# Altium project KS2E-BSPD.PrjPcb
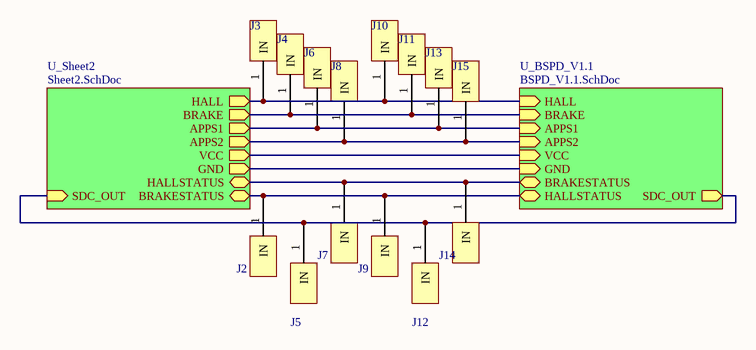
[diagram p0: Sheet3.SchDoc]
3 sheets, 59 parts. Net scope: hierarchical (ports join the sheet entries above them; power ports are global).
Board file: BSPD_V1.1.PcbDoc
Sheets:
  Sheet3.SchDoc
    U_BSPD_V1.1 = BSPD_V1.1.SchDoc
    U_Sheet2 = Sheet2.SchDoc

## Sheet Sheet3.SchDoc
size A; SheetNumber: 1; SheetTotal: 3

### Parts
J2  22AWG JUMPER  [22 AWG Hole]  (value not drawn)
J3  22AWG JUMPER  [22 AWG Hole]  (value not drawn)
J4  22AWG JUMPER  [22 AWG Hole]  (value not drawn)
J5  22AWG JUMPER  [22 AWG Hole]  (value not drawn)
J6  22AWG JUMPER  [22 AWG Hole]  (value not drawn)
J7  22AWG JUMPER  [22 AWG Hole]  (value not drawn)
J8  22AWG JUMPER  [22 AWG Hole]  (value not drawn)
J9  22AWG JUMPER  [22 AWG Hole]  (value not drawn)
J10  22AWG JUMPER  [22 AWG Hole]  (value not drawn)
J11  22AWG JUMPER  [22 AWG Hole]  (value not drawn)
J12  22AWG JUMPER  [22 AWG Hole]  (value not drawn)
J13  22AWG JUMPER  [22 AWG Hole]  (value not drawn)
J14  22AWG JUMPER  [22 AWG Hole]  (value not drawn)
J15  22AWG JUMPER  [22 AWG Hole]  (value not drawn)

### Sub-sheets
U_BSPD_V1.1 = BSPD_V1.1.SchDoc: SDC_OUT (out), HALL (in), BRAKE (in), APPS1 (in), APPS2 (in), VCC (in), GND (in), BRAKESTATUS (bidir), HALLSTATUS (bidir)
U_Sheet2 = Sheet2.SchDoc: SDC_OUT (in), HALL (out), BRAKE (out), APPS1 (out), APPS2 (out), VCC (out), GND (out), BRAKESTATUS (bidir), HALLSTATUS (bidir)

### Nets
GND: sheet U_BSPD_V1.1/GND, sheet U_Sheet2/GND
VCC: sheet U_BSPD_V1.1/VCC, sheet U_Sheet2/VCC
APPS1: J6.1(IN) J13.1(IN) ; sheet U_BSPD_V1.1/APPS1, sheet U_Sheet2/APPS1
APPS2: J8.1(IN) J15.1(IN) ; sheet U_BSPD_V1.1/APPS2, sheet U_Sheet2/APPS2
BRAKE: J4.1(IN) J11.1(IN) ; sheet U_BSPD_V1.1/BRAKE, sheet U_Sheet2/BRAKE
BRAKECHECK: J7.1(IN) J14.1(IN) ; sheet U_BSPD_V1.1/BRAKESTATUS, sheet U_Sheet2/HALLSTATUS
HALL: J3.1(IN) J10.1(IN) ; sheet U_BSPD_V1.1/HALL, sheet U_Sheet2/HALL
HALLCHECK: J2.1(IN) J9.1(IN) ; sheet U_BSPD_V1.1/HALLSTATUS, sheet U_Sheet2/BRAKESTATUS
NetJ5_1: J5.1(IN) J12.1(IN) ; sheet U_BSPD_V1.1/SDC_OUT, sheet U_Sheet2/SDC_OUT

## Sheet BSPD_V1.1.SchDoc
size A; SheetNumber: 2; SheetTotal: 3
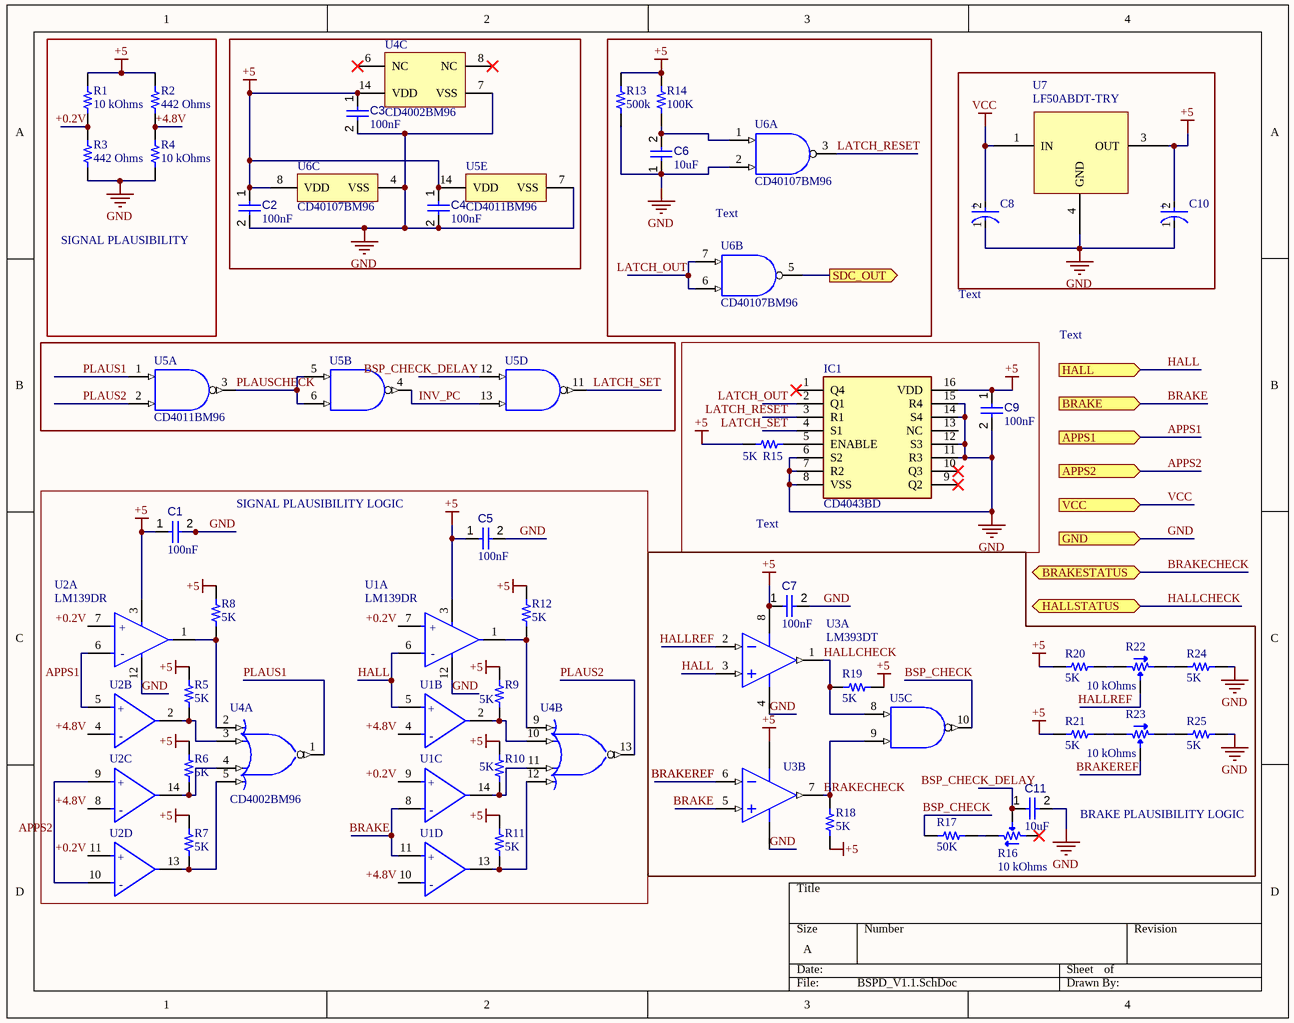
[diagram p1: BSPD_V1.1.SchDoc]

### Parts
C1  value 100nF  [CAPC1608X90X40NL10T20]  (hidden comment: Capacitor 100 nF +/-10% 50 V 0603)
C2  value 100nF  [CAPC1608X90X40NL10T20]  (hidden comment: Capacitor 100 nF +/-10% 50 V 0603)
C3  value 100nF  [CAPC1608X90X40NL10T20]  (hidden comment: Capacitor 100 nF +/-10% 50 V 0603)
C4  value 100nF  [CAPC1608X90X40NL10T20]  (hidden comment: Capacitor 100 nF +/-10% 50 V 0603)
C5  value 100nF  [CAPC1608X90X40NL10T20]  (hidden comment: Capacitor 100 nF +/-10% 50 V 0603)
C6  value 10uF  [CAPC1608X90X40NL10T20]  (hidden comment: Capacitor 100 nF +/-10% 50 V 0603)
C7  value 100nF  [CAPC1608X90X40NL10T20]  (hidden comment: Capacitor 100 nF +/-10% 50 V 0603)
C8  EEEFK1E100R  [FP-FKB-MFG]  (value not drawn)
C9  value 100nF  [CAPC1608X90X40NL10T20]  (hidden comment: Capacitor 100 nF +/-10% 50 V 0603)
C10  EEEFK1E100R  [FP-FKB-MFG]  (value not drawn)
C11  value 10uF  [CAPC1608X90X40NL10T20]  (hidden comment: Capacitor 100 nF +/-10% 50 V 0603)
IC1  CD4043BD  [SOIC127P600X175-16N]
R1  10 kOhms  [RES 0603_1608]
R2  442 Ohms  [RES 0603_1608]
R3  442 Ohms  [RES 0603_1608]
R4  10 kOhms  [RES 0603_1608]
R5  5K  [RES 0603_1608]
R6  5K  [RES 0603_1608]
R7  5K  [RES 0603_1608]
R8  5K  [RES 0603_1608]
R9  5K  [RES 0603_1608]
R10  5K  [RES 0603_1608]
R11  5K  [RES 0603_1608]
R12  5K  [RES 0603_1608]
R13  500k  [RES 0603_1608]
R14  100K  [RES 0603_1608]
R15  5K  [RES 0603_1608]
R16  10 kOhms  [POT BOURNS TRIMPOT TC33]
R17  50K  [RES 0603_1608]
R18  5K  [RES 0603_1608]
R19  5K  [RES 0603_1608]
R20  5K  [RES 0603_1608]
R21  5K  [RES 0603_1608]
R22  10 kOhms  [POT BOURNS TRIMPOT TC33]
R23  10 kOhms  [POT BOURNS TRIMPOT TC33]
R24  5K  [RES 0603_1608]
R25  5K  [RES 0603_1608]
U1  LM139DR  [FP-D0014A-IPC_C]  (parts A,B,C,D of 4)
U2  LM139DR  [FP-D0014A-IPC_C]  (parts A,B,C,D of 4)
U3  LM393DT  [STM-SO-8_D_L]  (parts A,B of 2)
U4  CD4002BM96  [D0014A_L]  (parts A,B,C of 3)
U5  CD4011BM96  [D0014A_L]  (parts A,B,C,D,E of 5)
U6  CD40107BM96  [D0008A_N]  (parts A,B,C of 3)
U7  LF50ABDT-TRY  [DPAK228P972X238-3N]

### Blocks framed on the sheet
SIGNAL PLAUSIBILITY: R1-R4
Text: C6 R13 R14 U6
Text: C9 IC1 R15
SIGNAL PLAUSIBILITY LOGIC: C1 C5 R5-R12 U1 U2 U4
BRAKE PLAUSIBILITY LOGIC: C7 C11 R16-R25 U3 U5

### Ports
APPS1 (in), APPS2 (in), BRAKE (in), BRAKESTATUS (bidir), GND (in), HALL (in), HALLSTATUS (bidir), SDC_OUT (out), VCC (in)

### Nets
+5: C1.1 C2.1 C3.1 C4.1 C5.1 C7.1 C9.1 C10.2(A) IC1.16(VDD) R1.2 R2.1 R5.1 R6.1 R7.1 R8.1 R9.1 R10.1 R11.1 R12.1 R13.2 R14.2 R15.2 R18.1 R19.1 R20.1 R21.1 U1.3(VCC) U2.3(VCC) U3.8(VCC+) U4.14(VDD) U5.14(VDD) U6.8(VDD) U7.3(OUT)
GND: C1.2 C2.2 C3.2 C4.2 C5.2 C6.1 C7.2 C8.1(C) C9.2 C10.1(C) C11.2 IC1.6(S2) IC1.7(R2) IC1.8(VSS) IC1.11(R3) IC1.12(S3) IC1.14(S4) IC1.15(R4) R3.1 R4.1 R13.1 R24.1 R25.1 U1.12(GND) U2.12(GND) U3.4(VCC-) U4.7(VSS) U5.7(VSS) U6.2(B) U6.4(VSS) U7.4(GND) ; port GND
VCC: C8.2(A) U7.1(IN) ; port VCC
+0.2V: R1.1 R3.2 U1.7(1IN+) U1.9(3IN+) U2.7(1IN+) U2.11(4IN+)
+4.8V: R2.2 R4.2 U1.4(2IN-) U1.10(4IN-) U2.4(2IN-) U2.8(3IN-)
APPS1: U2.5(2IN+) U2.6(1IN-) ; port APPS1
APPS2: U2.9(3IN+) U2.10(4IN-) ; port APPS2
BRAKE: U1.8(3IN-) U1.11(4IN+) U3.5(IN2+) ; port BRAKE
BRAKECHECK: R18.2 U3.7(OUT2) U5.9(F) ; port BRAKESTATUS
BRAKEREF: R23.2 U3.6(IN2-)
BSP_CHECK: R17.2 U5.10(L)
BSP_CHECK_DELAY: C11.1 R16.2 U5.12(G)
HALL: U1.5(2IN+) U1.6(1IN-) U3.3(IN1+) ; port HALL
HALLCHECK: R19.2 U3.1(OUT1) U5.8(E) ; port HALLSTATUS
HALLREF: R22.2 U3.2(IN1-)
INV_PC: U5.4(K) U5.13(H)
LATCH_OUT: IC1.2(Q1) U6.6(E) U6.7(D)
LATCH_RESET: IC1.3(R1) U6.3(C)
LATCH_SET: IC1.4(S1) U5.11(M)
PLAUS1: U4.1(J) U5.1(A)
PLAUS2: U4.13(K) U5.2(B)
PLAUSCHECK: U5.3(J) U5.5(C) U5.6(D)
NetC6_2: C6.2 R14.1 U6.1(A)
NetIC1_5: IC1.5(ENABLE) R15.1
NetJ5_1: U6.5(F) ; port SDC_OUT
NetR5_2: R5.2 U2.2(2OUT) U4.3(B)
NetR6_2: R6.2 U2.14(OUT3) U4.4(C)
NetR7_2: R7.2 U2.13(OUT4) U4.5(D)
NetR8_2: R8.2 U2.1(1OUT) U4.2(A)
NetR9_2: R9.2 U1.2(2OUT) U4.10(F)
NetR10_2: R10.2 U1.14(OUT3) U4.11(G)
NetR11_2: R11.2 U1.13(OUT4) U4.12(H)
NetR12_2: R12.2 U1.1(1OUT) U4.9(E)
NetR16_3: R16.3 R17.1
NetR20_2: R20.2 R22.1
NetR21_2: R21.2 R23.1
NetR22_3: R22.3 R24.2
NetR23_3: R23.3 R25.2

Not connected (* = marked no-connect by the designer): IC1 1(Q4)* 9(Q2)* 10(Q3)* 13(NC); R16 1*; U4 6(NC)* 8(NC)*

### Notes on the sheet
- Text
- (in symbol CMP-04896-000042-1, part A) +; -
- (in symbol CMP-04896-000042-1, part B) +; -
- (in symbol CMP-04896-000042-1, part C) +; -
- (in symbol CMP-04896-000042-1, part D) +; -
- (in symbol CMP-05427-000055-1) +

### Library data of the parts
C1-C7 C9 C11 = CMP-001-00017-6: Chip Capacitor, 100 nF, +/- 10%, 50 V, 0603 (1608 Metric); Voltage Rating: 50V; Capacitor Type: Ceramic; Tolerance: 10%; Mounting Technology: SM; Max Operating Temperature: 125°C; RoHS Compliant: True; Pins: 2; Case/Package: 0603; Min Operating Temperature: -55°C
C8 C10 = CMP-05427-000055-1: CAP ALUM 10UF 20% 25V SMD; ESR (Equivalent Series Resistance): 1.35R; Life (Hours): 2000Hour; Dielectric Material: Aluminium; Leakage Current: 3uA; Ripple Current (AC): 90mA; Polarity: Polar; Voltage: 25V; Voltage Rating: 25V; Number of Pins: 2; Package Quantity: 1; Max Operating Temperature: 105°C; Tolerance: 20%; Voltage Rating (DC): 25V; Packaging: Tape and Reel; Impedance: 1.35R; Case/Package: Radial; Series: FK; Height - Seated (Max): 0.24inch; Diameter: 4mm; Length: 5.8mm; Construction: Cylindrical; Height: 5.8mm; Mount: Surface Mount; REACH SVHC: No SVHC; Termination: SMD/SMT; Capacitance: 10uF; Lead Free: Lead Free; RoHS Compliant: Yes; Contact Plating: Tin; Width: 5.5mm; Radiation Hardening: No; Min Operating Temperature: -55°C; Ripple Current: 90mA
IC1 = CD4043BD: Integrated Circuit; Manufacturer_Name: Texas Instruments; Datasheet Link: http://www.ti.com/lit/gpn/CD4043B; Height: 1.75mm; Manufacturer_Part_Number: CD4043BD; Mouser Part Number: 595-CD4043BD; Mouser Price/Stock: https://www.mouser.co.uk/ProductDetail/Texas-Instruments/CD4043BD?qs=LSR%252BNeaw%2FwBT%2FmtVlwfGdg%3D%3D; Arrow Part Number: CD4043BD; Arrow Price/Stock: https://www.arrow.com/en/products/cd4043bd/texas-instruments
R1 R4 = CPF0603B10KE: RES SMD 10K OHM 0.1% 1/16W 0603; Manufacturer: TE Connectivity Passive Product; Power (Watts): 0.063W, 1/16W; Temperature Coefficient: ±25ppm/°C; Part Number: CPF0603B10KE; Value: 10 kOhms; ComponentLink1Description: Datasheet; ComponentLink1URL: https://www.te.com/commerce/DocumentDelivery/DDEController?Action=srchrtrv&DocNm=1773200&DocType=DS&DocLang=English; ComponentLink2Description: DigiKey Link; ComponentLink2URL: http://digikey.com/product-detail/en/te-connectivity-passive-product/CPF0603B10KE/A119886CT-ND/4966484; Composition: Thin Film; Device Package: 0603 (1608 Metric); Height - Seated (Max): 0.022" (0.55mm); LastUpdated: 9/2/2020 1:10:25 AM; Lifecycle Status: Active; Minimum Order: 1; Number of Terminations: 2; Operating Temperature: -55°C ~ 155°C; Package / Case: 0603 (1608 Metric); Packaging: TapeAndReel; PartId: 4872; Part Status: Active; Price: 0.09; Resistance: 10 kOhms; Series: CPF, Neohm; Size / Dimension: 0.061" L x 0.031" W (1.55mm x 0.80mm); Supplier 1: DigiKey; Supplier Part Number 1: A119886CT-ND; Supplier Device Package: 0603; Tolerance: ±0.1%
R2 R3 = RK73H1JTTD4420F: RES 442 OHM 1% 1/8W 0603; Manufacturer: KOA Speer Electronics, Inc.; Power (Watts): 0.125W, 1/8W; Temperature Coefficient: ±100ppm/°C; Part Number: RK73H1JTTD4420F; Value: 442 Ohms; ComponentLink1Description: Datasheet; ComponentLink1URL: http://www.koaspeer.com/catimages/Products/RK73H/RK73H.pdf; ComponentLink2Description: DigiKey Link; ComponentLink2URL: http://digikey.com/product-detail/en/koa-speer-electronics-inc/RK73H1JTTD4420F/2019-RK73H1JTTD4420FCT-ND/9847257; Composition: Thick Film; Device Package: 0603 (1608 Metric); Features: Automotive AEC-Q200, Moisture Resistant; Height - Seated (Max): 0.022" (0.55mm); LastUpdated: 9/2/2020 1:09:26 AM; Lifecycle Status: Active; Minimum Order: 1; Number of Terminations: 2; Operating Temperature: -55°C ~ 155°C; Package / Case: 0603 (1608 Metric); Packaging: CutTape; PartId: 26603; Part Status: Active; Price: 0.10; Ratings: AEC-Q200; Resistance: 442 Ohms; Series: RK73H; Size / Dimension: 0.063" L x 0.031" W (1.60mm x 0.80mm); Supplier 1: DigiKey; Supplier Part Number 1: 2019-RK73H1JTTD4420FCT-ND; Supplier Device Package: 0603; Tolerance: ±1%
R5-R12 R15 R18-R21 R24 R25 = CRGP0603F5K6: CRGP 0603 5K6 1%; Manufacturer: TE Connectivity Passive Product; Power (Watts): 0.25W, 1/4W; Resistance: 5.6 kOhms; Temperature Coefficient: ±100ppm/°C; Part Number: CRGP0603F5K6; Value: 5K; ComponentLink1Description: Datasheet; ComponentLink1URL: https://www.te.com/commerce/DocumentDelivery/DDEController?Action=srchrtrv&DocNm=9-1773463-9&DocType=DS&DocLang=English; ComponentLink2Description: DigiKey Link; ComponentLink2URL: http://digikey.com/product-detail/en/te-connectivity-passive-product/CRGP0603F5K6/A130425CT-ND/8578257; Composition: Thick Film; Device Package: 0603 (1608 Metric); Features: Pulse Withstanding; Height - Seated (Max): 0.022" (0.55mm); LastUpdated: 9/2/2020 1:09:50 AM; Lifecycle Status: Active; Minimum Order: 1; Number of Terminations: 2; Operating Temperature: -55°C ~ 155°C; Package / Case: 0603 (1608 Metric); Packaging: TapeAndReel; PartId: 20907; Part Status: Active; Price: 0.02; Series: CRGP; Size / Dimension: 0.063" L x 0.031" W (1.60mm x 0.80mm); Supplier 1: DigiKey; Supplier Part Number 1: A130425CT-ND; Supplier Device Package: 0603; Tolerance: ±1%
R13 = CRGP0603F5K6: CRGP 0603 5K6 1%; Manufacturer: TE Connectivity Passive Product; Power (Watts): 0.25W, 1/4W; Temperature Coefficient: ±100ppm/°C; Part Number: CRGP0603F5K6; Value: 500k; ComponentLink1Description: Datasheet; ComponentLink1URL: https://www.te.com/commerce/DocumentDelivery/DDEController?Action=srchrtrv&DocNm=9-1773463-9&DocType=DS&DocLang=English; ComponentLink2Description: DigiKey Link; ComponentLink2URL: http://digikey.com/product-detail/en/te-connectivity-passive-product/CRGP0603F5K6/A130425CT-ND/8578257; Composition: Thick Film; Device Package: 0603 (1608 Metric); Features: Pulse Withstanding; Height - Seated (Max): 0.022" (0.55mm); LastUpdated: 9/2/2020 1:09:50 AM; Lifecycle Status: Active; Minimum Order: 1; Number of Terminations: 2; Operating Temperature: -55°C ~ 155°C; Package / Case: 0603 (1608 Metric); Packaging: TapeAndReel; PartId: 20907; Part Status: Active; Price: 0.02; Resistance: 500k; Series: CRGP; Size / Dimension: 0.063" L x 0.031" W (1.60mm x 0.80mm); Supplier 1: DigiKey; Supplier Part Number 1: A130425CT-ND; Supplier Device Package: 0603; Tolerance: ±1%
R14 = CRGP0603F5K6: CRGP 0603 5K6 1%; Manufacturer: TE Connectivity Passive Product; Power (Watts): 0.25W, 1/4W; Resistance: 100KOHM; Temperature Coefficient: ±100ppm/°C; Part Number: CRGP0603F5K6; Value: 100K; ComponentLink1Description: Datasheet; ComponentLink1URL: https://www.te.com/commerce/DocumentDelivery/DDEController?Action=srchrtrv&DocNm=9-1773463-9&DocType=DS&DocLang=English; ComponentLink2Description: DigiKey Link; ComponentLink2URL: http://digikey.com/product-detail/en/te-connectivity-passive-product/CRGP0603F5K6/A130425CT-ND/8578257; Composition: Thick Film; Device Package: 0603 (1608 Metric); Features: Pulse Withstanding; Height - Seated (Max): 0.022" (0.55mm); LastUpdated: 9/2/2020 1:09:50 AM; Lifecycle Status: Active; Minimum Order: 1; Number of Terminations: 2; Operating Temperature: -55°C ~ 155°C; Package / Case: 0603 (1608 Metric); Packaging: TapeAndReel; PartId: 20907; Part Status: Active; Price: 0.02; Series: CRGP; Size / Dimension: 0.063" L x 0.031" W (1.60mm x 0.80mm); Supplier 1: DigiKey; Supplier Part Number 1: A130425CT-ND; Supplier Device Package: 0603; Tolerance: ±1%
R16 R22 R23 = TC33X-2-103E: TRIMMER 10K OHM 0.1W J LEAD TOP; Manufacturer: Bourns Inc.; Adjustment Type: Top Adjustment; Number of Turns: 1; Power (Watts): 0.1W, 1/10W; Resistive Material: Cermet; Temperature Coefficient: ±250ppm/°C; Tolerance: ±25%; Part Number: TC33X-2-103E; ComponentLink1Description: Datasheet; ComponentLink1URL: https://www.bourns.com/docs/Product-Datasheets/TC33.pdf; ComponentLink2Description: DigiKey Link; ComponentLink2URL: http://digikey.com/product-detail/en/bourns-inc/TC33X-2-103E/TC33X-103ECT-ND/612911; LastUpdated: 9/2/2020 1:21:42 AM; Lifecycle Status: Active; Minimum Order: 1; Mounting Type: Surface Mount; Packaging: TapeAndReel; PartId: 8; Part Status: Active; Price: 0.15; Resistance: 10 kOhms; Series: Trimpot® TC33 - Open Frame; Size / Dimension: Rectangular - 0.150" x 0.142" Face x 0.047" H (3.80mm x 3.60mm x 1.20mm); Supplier 1: DigiKey; Supplier Part Number 1: TC33X-103ECT-ND; Termination Style: J Lead; Value: 10 kOhms
R17 = CRGP0603F5K6: CRGP 0603 5K6 1%; Manufacturer: TE Connectivity Passive Product; Power (Watts): 0.25W, 1/4W; Resistance: 50KOHM; Temperature Coefficient: ±100ppm/°C; Part Number: CRGP0603F5K6; Value: 50K; ComponentLink1Description: Datasheet; ComponentLink1URL: https://www.te.com/commerce/DocumentDelivery/DDEController?Action=srchrtrv&DocNm=9-1773463-9&DocType=DS&DocLang=English; ComponentLink2Description: DigiKey Link; ComponentLink2URL: http://digikey.com/product-detail/en/te-connectivity-passive-product/CRGP0603F5K6/A130425CT-ND/8578257; Composition: Thick Film; Device Package: 0603 (1608 Metric); Features: Pulse Withstanding; Height - Seated (Max): 0.022" (0.55mm); LastUpdated: 9/2/2020 1:09:50 AM; Lifecycle Status: Active; Minimum Order: 1; Number of Terminations: 2; Operating Temperature: -55°C ~ 155°C; Package / Case: 0603 (1608 Metric); Packaging: TapeAndReel; PartId: 20907; Part Status: Active; Price: 0.02; Series: CRGP; Size / Dimension: 0.063" L x 0.031" W (1.60mm x 0.80mm); Supplier 1: DigiKey; Supplier Part Number 1: A130425CT-ND; Supplier Device Package: 0603; Tolerance: ±1%
U1 U2 = CMP-04896-000042-1: IC QUAD DIFF COMPARATOR 14-SOIC; Min Supply Voltage: 2V; Output Current per Channel: 6mA; Output Type: TTL; Quiescent Current: 2mA; Max Input Current: 100nA; Number of Elements: 4; Max Supply Voltage: 36V; Dual Supply Voltage: 9V; Input Offset Voltage (Vos): 5mV; Operating Supply Voltage: 28V; Response Time: 0.3us; Max Supply Current: 500uA; Max Power Dissipation: 1.19W; Voltage Gain: 106.02dB; Min Dual Supply Voltage: 1V; Max Dual Supply Voltage: 18V; Output Current: 20mA; Packaging: Tape and Reel; Contact Plating: Gold; Max Operating Temperature: 125°C; Width: 3.91mm; Weight: 0.004515oz; Number of Pins: 14; Height: 1.58mm; REACH SVHC: No SVHC; Supply Current: 2mA; Min Operating Temperature: -55°C; Input Bias Current: 100nA; Package Quantity: 1; Radiation Hardening: No; Technology: BIPOLAR; Series: LM139; Lead Free: Lead Free; Length: 8.65mm; Mount: Surface Mount; Case/Package: SOIC; Number of Channels: 4; RoHS Compliant: Yes; Nominal Supply Current: 2mA
U3 = CMP-2000-06550-1: Low-Power, Dual-Voltage Comparator, 2 to 36 V, 0 to 70 degC, 8-Pin SOIC (SO), RoHS, Tape and Reel; Manufacturer: STMicroelectronics; Voltage - Supply, Single/Dual (±): 2V~36V,±1V~18V; Current - Input Bias (Max): 0.25µA@5V; Number of Elements: 2; Current - Output (Typ): 18mA@5V; Other Names: 497-1593-2; Voltage - Input Offset (Max): 5mV@30V; Output Type: CMOS,DTL,ECL,MOS,Open-Collector,TTL; EDA / CAD Models: DownloadfromAcceleratedDesigns; Other Related Documents: LM393ViewAllSpecificationsLM393ViewAllSpecifications; Online Catalog: Comparators-2elements; Current - Quiescent (Max): 2.5mA; Standard Package: 2,500; Manufacturer URL: http://www.st.com/; Package Description: 8-Pin Small Outline Integrated Circuit, Body 4.9 x 3.9 mm, Pitch 1.27 mm; Packaging: Tape&Reel(TR); Datasheet Version: Rev. 15, 02/2016; Category: IntegratedCircuits(ICs); Operating Temperature: 0°C~70°C; Mounting Type: SurfaceMount; Supplier Device Package: 8-SO; Datasheet URL: http://www.st.com/content/ccc/resource/technical/document/datasheet/group1/b4/cc/cf/13/18/28/44/f5/CD00000465/files/CD00000465.pdf/jcr:content/translations/en.CD00000465.pdf; Family: Linear-Comparators; Mounting Technology: SurfaceMount; Type: GeneralPurpose; Package Reference: SO-8; Package / Case: 8-SOIC(0.154",3.90mmWidth)
U4 = CMP-0806-00069-3: CMOS Dual 4-Input NOR Gate, D0014A, LARGE T&R; Manufacturer: Texas Instruments; tpd @ Nom Voltage(Max)(ns): 120; VCC(Min)(V): 3; VCC(Max)(V): 18; ICC @ Nom Voltage(Max)(mA): 0.015; Bits(#): 2; F @ Nom Voltage(Max)(Mhz): 8; Output Drive (IOL/IOH)(Max)(mA): 1.5/-1.5; Rating: Catalog; Voltage(Nom)(V): 10; PackageReference: D0014A; Output Type: CMOS; Generic Part Number: CD4002B; Input Type: CMOS; DatasheetVersion: SCHS015C; Operating Temperature Range(C): -55 to 125; PackageVersion: http://www.ti.com/lit/ml/mpds177g/mpds177g.pdf; Code_JEDEC: MS-012
U5 = CMP-1627-00065-2: CMOS Quad 2-Input NAND Gate, D0014A, LARGE T&R; Manufacturer: Texas Instruments; Voltage(Nom)(V): 10; Output Drive (IOL/IOH)(Max)(mA): 1.5/-1.5; VCC(Max)(V): 18; F @ Nom Voltage(Max)(Mhz): 8; Rating: Military; Bits(#): 4; Technology Family: CD4000; ICC @ Nom Voltage(Max)(mA): 0.015; VCC(Min)(V): 3; Schmitt Trigger: No; Operating Temperature Range(C): -55 to 125; Input Type: CMOS; DatasheetVersion: SCHS021D; PackageReference: D0014A; Code_JEDEC: MS-012; Output Type: CMOS; Generic Part Number: CD4011B
U6 = CMP-1627-00002-2: CMOS Dual 2-Input NAND Buffer/Driver, D0008A, LARGE T&R; Manufacturer: Texas Instruments; VCC(Min)(V): 3; F @ Nom Voltage(Max)(Mhz): 8; Rating: Catalog; Voltage(Nom)(V): 10; VCC(Max)(V): 18; Output Drive (IOL/IOH)(Max)(mA): 0/-85; ICC @ Nom Voltage(Max)(mA): 0.06; Technology Family: CD4000; Bits(#): 2; Schmitt Trigger: No; Input Type: CMOS; Operating Temperature Range(C): -55 to 125; DatasheetVersion: SCHS098D; Generic Part Number: CD40107B; Output Type: CMOS; PackageReference: D0008A
U7 = LF50ABDT-TRY: Linear Voltage Regulator IC Positive Fixed 1 Output 500mA DPAK

## Sheet Sheet2.SchDoc
size A; SheetNumber: 3; SheetTotal: 3
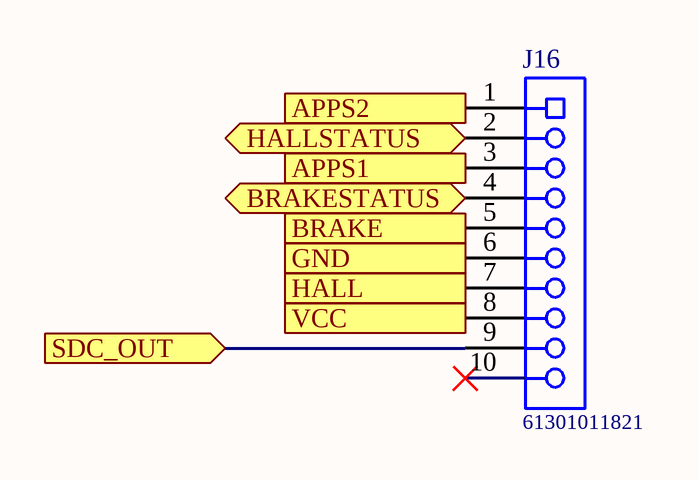
[diagram p2: Sheet2.SchDoc]

### Parts
J16  61301011821  [61301011821]

### Ports
APPS1 (out), APPS2 (out), BRAKE (out), BRAKESTATUS (bidir), GND (out), HALL (out), HALLSTATUS (bidir), SDC_OUT (in), VCC (out)

### Nets
GND: J16.6 ; port GND
VCC: J16.8 ; port VCC
APPS1: J16.3 ; port APPS1
APPS2: J16.1 ; port APPS2
BRAKE: J16.5 ; port BRAKE
BRAKECHECK: J16.2 ; port HALLSTATUS
HALL: J16.7 ; port HALL
HALLCHECK: J16.4 ; port BRAKESTATUS
NetJ5_1: J16.9 ; port SDC_OUT

Not connected (* = marked no-connect by the designer): J16 10*

### Library data of the parts
J16 = CMP-1502-01332-1: THT Vertical Socket Header WR-PHD, Pitch 2.54 mm, Single Row, 10 pins; Manufacturer: Wurth Elektronik; Rated Current: 3A; Working Voltage: 250VAC; Gender: Female; Pitch: 2.54mm; Contact Resistance: 20mOhm; Pin Number: 10; Withstanding Voltage: 500VAC; Publisher: WurthElektronik; Orientation: Vertical; Row Number: Single; Package Reference: 61301011821; Packaging: Tray; Datasheet URL: https://katalog.we-online.de/em/datasheet/6130xx11821.pdf; Operating Temperature: -40to125degC; Part Number: 61301011821; Manufacturer URL: http://www.we-online.de; Mounting Technology: THT

## Nets that join several sheets
GND: BSPD_V1.1 (31 pins), Sheet2 (J16.6)
VCC: BSPD_V1.1 (C8.2 U7.1), Sheet2 (J16.8)
APPS1: Sheet3 (J6.1 J13.1), BSPD_V1.1 (U2.5 U2.6), Sheet2 (J16.3)
APPS2: Sheet3 (J8.1 J15.1), BSPD_V1.1 (U2.9 U2.10), Sheet2 (J16.1)
BRAKE: Sheet3 (J4.1 J11.1), BSPD_V1.1 (U1.8 U1.11 U3.5), Sheet2 (J16.5)
BRAKECHECK: Sheet3 (J7.1 J14.1), BSPD_V1.1 (R18.2 U3.7 U5.9), Sheet2 (J16.2)
HALL: Sheet3 (J3.1 J10.1), BSPD_V1.1 (U1.5 U1.6 U3.3), Sheet2 (J16.7)
HALLCHECK: Sheet3 (J2.1 J9.1), BSPD_V1.1 (R19.2 U3.1 U5.8), Sheet2 (J16.4)
NetJ5_1: Sheet3 (J5.1 J12.1), BSPD_V1.1 (U6.5), Sheet2 (J16.9)